# Altium schematic sheet Э3-2.SchDoc
size 840 x 594 mm; Address1: Address1; Address2: Address2; Address3: Address3; Address4: Address4; DocumentNumber: АБВГ.123456.001 Э3; SheetNumber: 2; SheetTotal: 2; Scale: 1:1; DocumentType: Схема электрическая принципиальная; FirstReferrence: АБВГ.123456.001
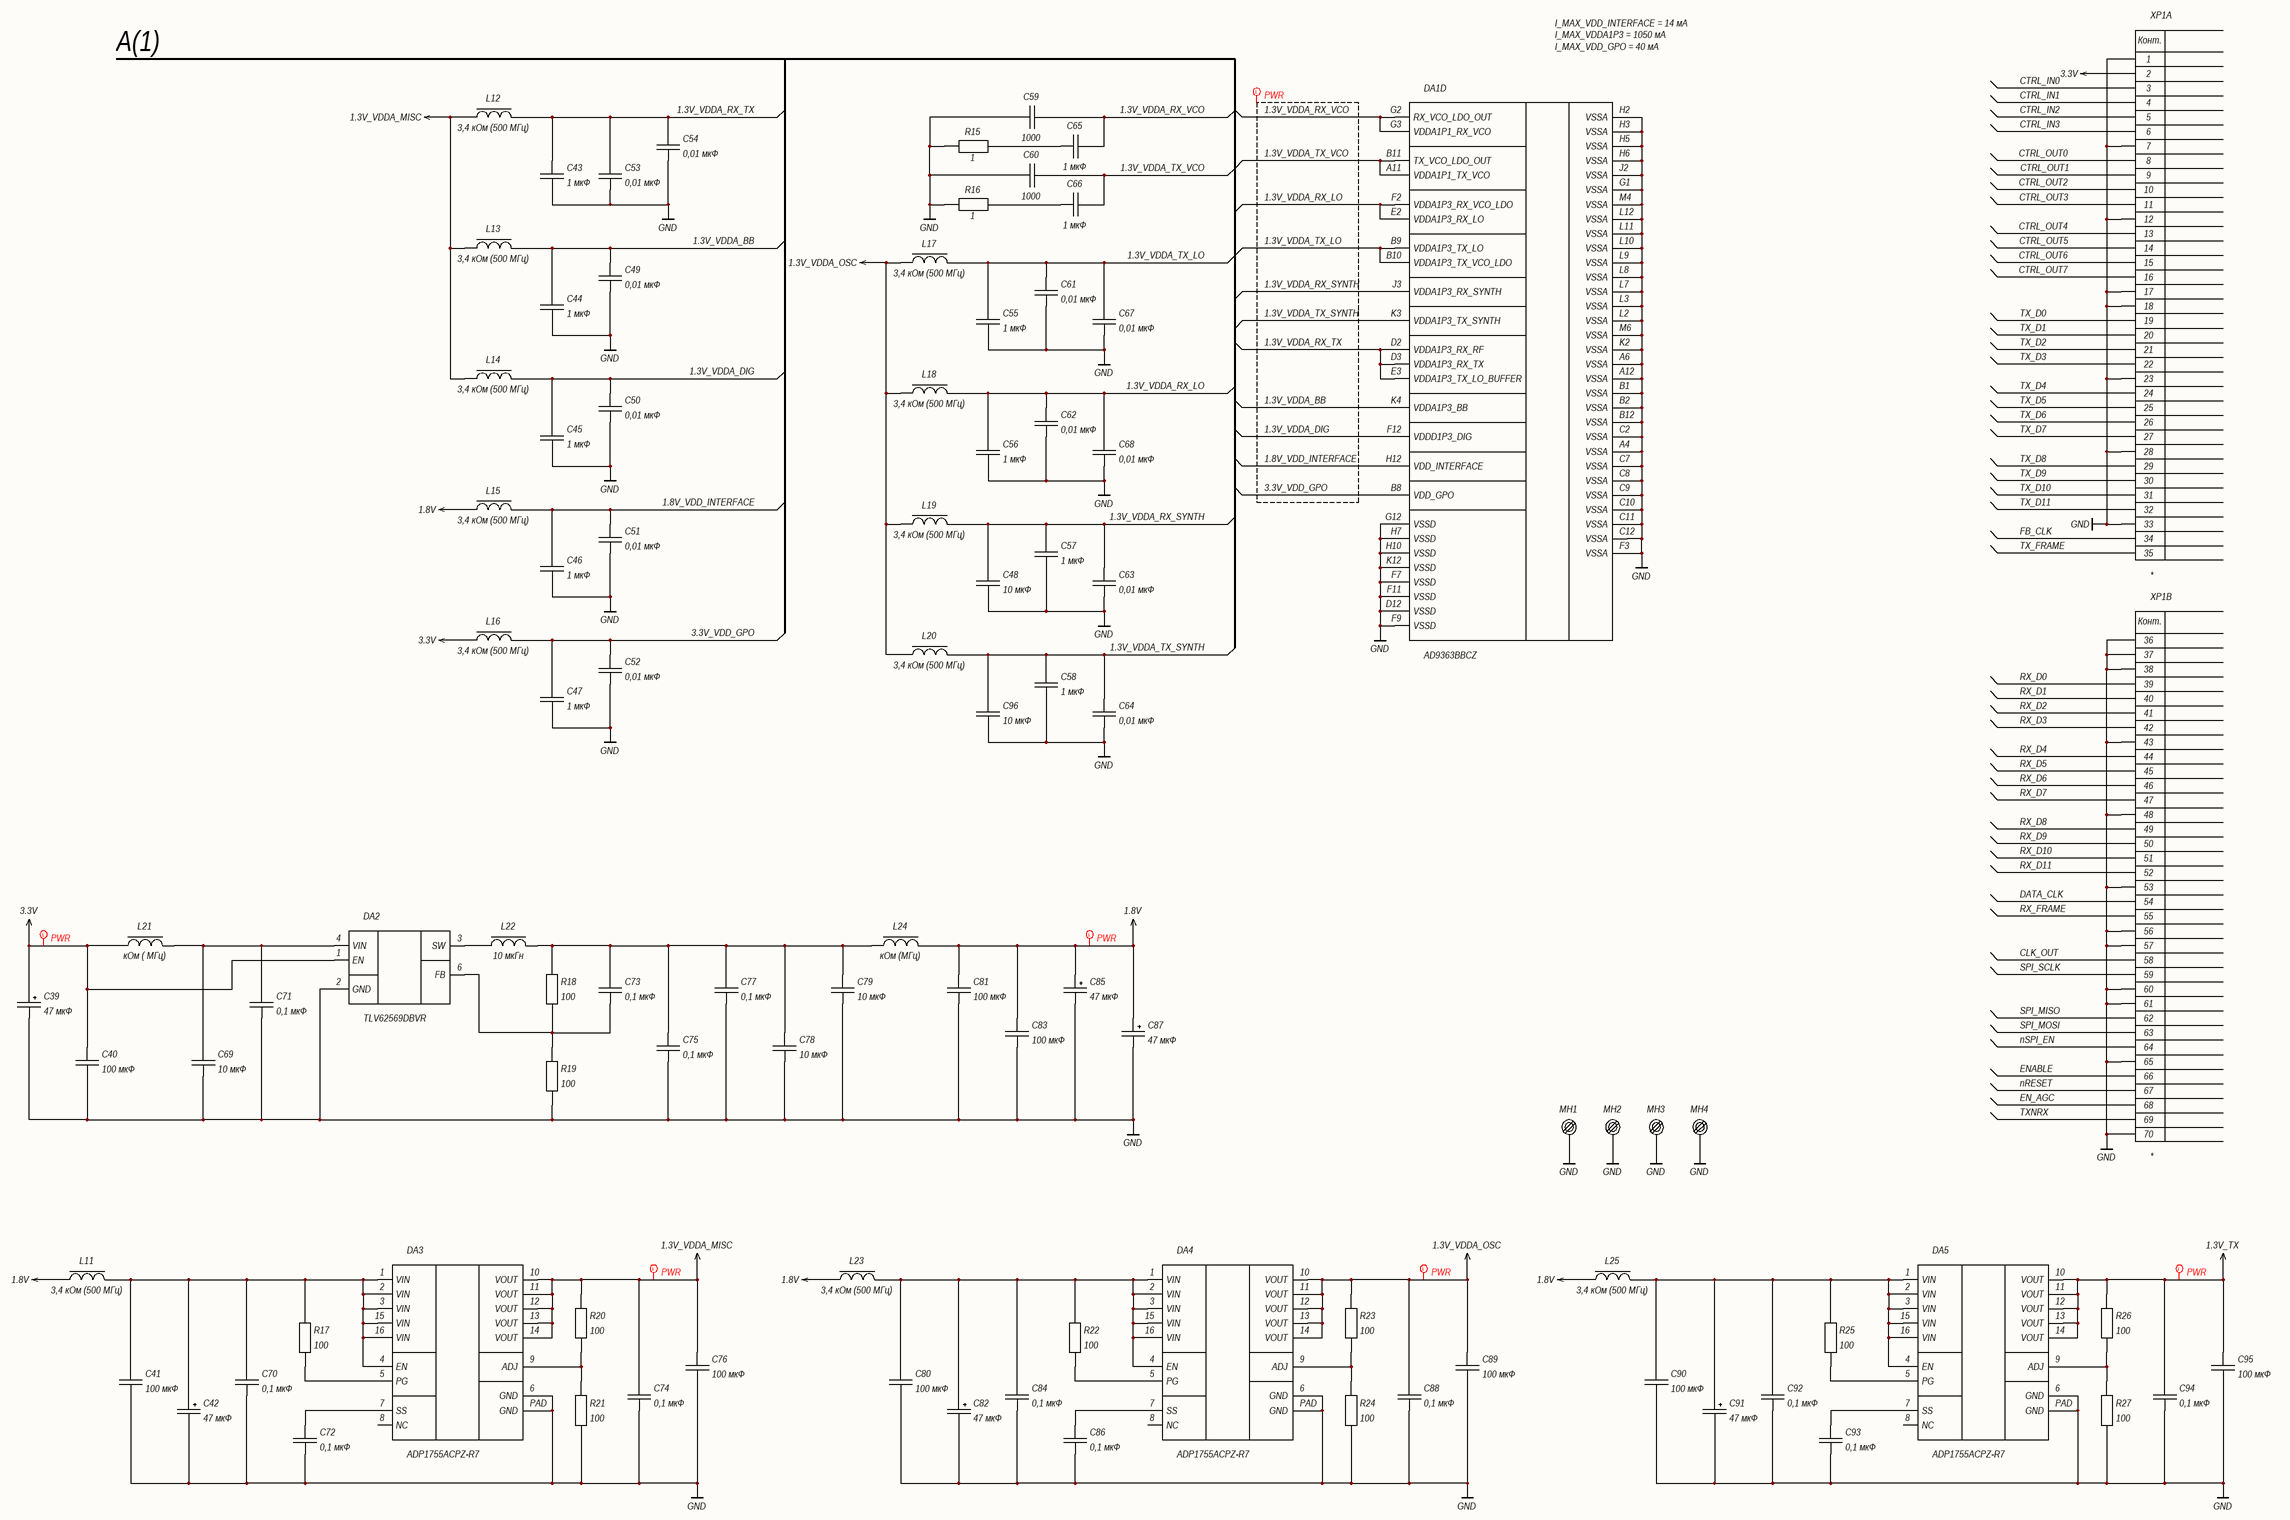
[diagram p0: Э3-2.SchDoc]

## Parts
C39  value 47 мкФ  [TL-A-B-1.8MM]
C40  value 100 мкФ  [C1206-B-1.6mm-NO]
C41  value 100 мкФ  [C1206-B-1.6mm]
C42  value 47 мкФ  [TL-A-B-1.8MM]
C43  value 1 мкФ  [C0402-B-0.5mm-NO]
C44  value 1 мкФ  [C0402-B-0.5mm-NO]
C45  value 1 мкФ  [C0402-B-0.5mm-NO]
C46  value 1 мкФ  [C0402-B-0.5mm-NO]
C47  value 1 мкФ  [C0402-B-0.5mm-NO]
C48  value 10 мкФ  [C0603-B-0.8mm-NO]
C49  value 0,01 мкФ  [C0201-B-0.3mm-NO]
C50  value 0,01 мкФ  [C0201-B-0.3mm-NO]
C51  value 0,01 мкФ  [C0201-B-0.3mm-NO]
C52  value 0,01 мкФ  [C0201-B-0.3mm-NO]
C53  value 0,01 мкФ  [C0201-B-0.3mm-NO]
C54  value 0,01 мкФ  [C0201-B-0.3mm-NO]
C55  value 1 мкФ  [C0402-B-0.5mm-NO]
C56  value 1 мкФ  [C0402-B-0.5mm-NO]
C57  value 1 мкФ  [C0402-B-0.5mm-NO]
C58  value 1 мкФ  [C0402-B-0.5mm-NO]
C59  value 1000  [C0201-B-0.3mm-NO]
C60  value 1000  [C0201-B-0.3mm-NO]
C61  value 0,01 мкФ  [C0201-B-0.3mm-NO]
C62  value 0,01 мкФ  [C0201-B-0.3mm-NO]
C63  value 0,01 мкФ  [C0201-B-0.3mm-NO]
C64  value 0,01 мкФ  [C0201-B-0.3mm-NO]
C65  value 1 мкФ  [C0402-B-0.5mm-NO]
C66  value 1 мкФ  [C0402-B-0.5mm-NO]
C67  value 0,01 мкФ  [C0201-B-0.3mm-NO]
C68  value 0,01 мкФ  [C0201-B-0.3mm-NO]
C69  value 10 мкФ  [C0603-B-0.8mm-NO]
C70  value 0,1 мкФ  [C0402-B-0.5mm-NO]
C71  value 0,1 мкФ  [C0402-B-0.5mm-NO]
C72  value 0,1 мкФ  [C0402-B-0.5mm-NO]
C73  value 0,1 мкФ  [C0402-B-0.5mm-NO]
C74  value 0,1 мкФ  [C0402-B-0.5mm-NO]
C75  value 0,1 мкФ  [C0402-B-0.5mm-NO]
C76  value 100 мкФ  [C1206-B-1.6mm]
C77  value 0,1 мкФ  [C0402-B-0.5mm-NO]
C78  value 10 мкФ  [C0603-B-0.8mm-NO]
C79  value 10 мкФ  [C0603-B-0.8mm-NO]
C80  value 100 мкФ  [C1206-B-1.6mm]
C81  value 100 мкФ  [C1206-B-1.6mm-NO]
C82  value 47 мкФ  [TL-A-B-1.8MM]
C83  value 100 мкФ  [C1206-B-1.6mm-NO]
C84  value 0,1 мкФ  [C0402-B-0.5mm-NO]
C85  value 47 мкФ  [TL-A-B-1.8MM]
C86  value 0,1 мкФ  [C0402-B-0.5mm-NO]
C87  value 47 мкФ  [TL-A-B-1.8MM]
C88  value 0,1 мкФ  [C0402-B-0.5mm-NO]
C89  value 100 мкФ  [C1206-B-1.6mm]
C90  value 100 мкФ  [C1206-B-1.6mm]
C91  value 47 мкФ  [TL-A-B-1.8MM]
C92  value 0,1 мкФ  [C0402-B-0.5mm-NO]
C93  value 0,1 мкФ  [C0402-B-0.5mm-NO]
C94  value 0,1 мкФ  [C0402-B-0.5mm-NO]
C95  value 100 мкФ  [C1206-B-1.6mm]
C96  value 10 мкФ  [C0603-B-0.8mm-NO]
DA1  AD9363BBCZ  [144-BGA]  (value not drawn)  (part D of 4)
DA2  TLV62569DBVR  [SOT-23-5]
DA3  ADP1755ACPZ-R7  [16-LFCSP-4-H0.75]
DA4  ADP1755ACPZ-R7  [16-LFCSP-4-H0.75]
DA5  ADP1755ACPZ-R7  [16-LFCSP-4-H0.75]
L11  value 3,4 кОм (500 МГц)  [L0402-B-0.5mm]
L12  value 3,4 кОм (500 МГц)  [L0402-B-0.5mm-NO]
L13  value 3,4 кОм (500 МГц)  [L0402-B-0.5mm-NO]
L14  value 3,4 кОм (500 МГц)  [L0402-B-0.5mm-NO]
L15  value 3,4 кОм (500 МГц)  [L0402-B-0.5mm-NO]
L16  value 3,4 кОм (500 МГц)  [L0402-B-0.5mm-NO]
L17  value 3,4 кОм (500 МГц)  [L0402-B-0.5mm-NO]
L18  value 3,4 кОм (500 МГц)  [L0402-B-0.5mm-NO]
L19  value 3,4 кОм (500 МГц)  [L0402-B-0.5mm-NO]
L20  value 3,4 кОм (500 МГц)  [L0402-B-0.5mm-NO]
L21  value кОм ( МГц)  [L0805-B-0.9mm]
L22  value 10 мкГн  [IHLP-2525CZ-01]
L23  value 3,4 кОм (500 МГц)  [L0402-B-0.5mm]
L24  value кОм (МГц)  [L0805-B-0.9mm]
L25  value 3,4 кОм (500 МГц)  [L0402-B-0.5mm]
MH1  Mechanical Connection  [Отверстие 3,2х7]  (value not drawn)
MH2  Mechanical Connection  [Отверстие 3,2х7]  (value not drawn)
MH3  Mechanical Connection  [Отверстие 3,2х7]  (value not drawn)
MH4  Mechanical Connection  [Отверстие 3,2х7]  (value not drawn)
R15  value 1  [CR0402-B-0.35mm-NO]
R16  value 1  [CR0402-B-0.35mm-NO]
R17  value 100  [CR0402-B-0.35mm-NO]
R18  value 100  [CR0402-B-0.35mm-NO]
R19  value 100  [CR0402-B-0.35mm-NO]
R20  value 100  [CR0402-B-0.35mm]
R21  value 100  [CR0402-B-0.35mm]
R22  value 100  [CR0402-B-0.35mm-NO]
R23  value 100  [CR0402-B-0.35mm]
R24  value 100  [CR0402-B-0.35mm]
R25  value 100  [CR0402-B-0.35mm-NO]
R26  value 100  [CR0402-B-0.35mm]
R27  value 100  [CR0402-B-0.35mm]
XP1  *  [PLD1.27-70-NO]  (parts A,B of 2)

## Nets
1.3V_TX: C94.1 C95.1 DA5.10(VOUT) DA5.11(VOUT) DA5.12(VOUT) DA5.13(VOUT) DA5.14(VOUT) R26.1
1.3V_VDDA_MISC: C74.1 C76.1 DA3.10(VOUT) DA3.11(VOUT) DA3.12(VOUT) DA3.13(VOUT) DA3.14(VOUT) L12.1 L13.1 L14.1 R20.1
1.3V_VDDA_OSC: C88.1 C89.1 DA4.10(VOUT) DA4.11(VOUT) DA4.12(VOUT) DA4.13(VOUT) DA4.14(VOUT) L17.1 L18.1 L19.1 L20.1 R23.1
1.8V: C81.1 C83.1 C85.1 C87.1 L11.1 L15.1 L23.1 L24.2 L25.1
3.3V: C39.1 C40.1 DA2.1(EN) L16.1 L21.1 XP1.2
GND: C39.2 C40.2 C41.2 C42.2 C43.2 C44.2 C45.2 C46.2 C47.2 C48.2 C49.2 C50.2 C51.2 C52.2 C53.2 C54.2 C55.2 C56.2 C57.2 C58.2 C59.1 C60.1 C61.2 C62.2 C63.2 C64.2 C67.2 C68.2 C69.2 C70.2 C71.2 C72.2 C74.2 C75.2 C76.2 C77.2 C78.2 C79.2 C80.2 C81.2 C82.2 C83.2 C84.2 C85.2 C86.2 C87.2 C88.2 C89.2 C90.2 C91.2 C92.2 C93.2 C94.2 C95.2 C96.2 DA1.A4(VSSA) DA1.A6(VSSA) DA1.A12(VSSA) DA1.B1(VSSA) DA1.B2(VSSA) DA1.B12(VSSA) DA1.C2(VSSA) DA1.C7(VSSA) DA1.C8(VSSA) DA1.C9(VSSA) DA1.C10(VSSA) DA1.C11(VSSA) DA1.C12(VSSA) DA1.D12(VSSD) DA1.F3(VSSA) DA1.F7(VSSD) DA1.F9(VSSD) DA1.F11(VSSD) DA1.G1(VSSA) DA1.G12(VSSD) DA1.H2(VSSA) DA1.H3(VSSA) DA1.H5(VSSA) DA1.H6(VSSA) DA1.H7(VSSD) DA1.H10(VSSD) DA1.J2(VSSA) DA1.K2(VSSA) DA1.K12(VSSD) DA1.L2(VSSA) DA1.L3(VSSA) DA1.L7(VSSA) DA1.L8(VSSA) DA1.L9(VSSA) DA1.L10(VSSA) DA1.L11(VSSA) DA1.L12(VSSA) DA1.M4(VSSA) DA1.M6(VSSA) DA2.2(GND) DA3.6(GND) DA3.PAD(GND) DA4.6(GND) DA4.PAD(GND) DA5.6(GND) DA5.PAD(GND) MH1.0 MH2.0 MH3.0 MH4.0 R15.1 R16.1 R19.2 R21.2 R24.2 R27.2 XP1.1 XP1.7 XP1.12 XP1.17 XP1.18 XP1.23 XP1.28 XP1.33 XP1.36 XP1.37 XP1.38 XP1.43 XP1.48 XP1.53 XP1.56 XP1.57 XP1.60 XP1.61 XP1.65 XP1.70
1.3V_VDDA_BB: C44.1 C49.1 DA1.K4(VDDA1P3_BB) L13.2
1.3V_VDDA_DIG: C45.1 C50.1 DA1.F12(VDDD1P3_DIG) L14.2
1.3V_VDDA_RX_LO: C56.1 C62.1 C68.1 DA1.E2(VDDA1P3_RX_LO) DA1.F2(VDDA1P3_RX_VCO_LDO) L18.2
1.3V_VDDA_RX_SYNTH: C48.1 C57.1 C63.1 DA1.J3(VDDA1P3_RX_SYNTH) L19.2
1.3V_VDDA_RX_TX: C43.1 C53.1 C54.1 DA1.D2(VDDA1P3_RX_RF) DA1.D3(VDDA1P3_RX_TX) DA1.E3(VDDA1P3_TX_LO_BUFFER) L12.2
1.3V_VDDA_RX_VCO: C59.2 C65.2 DA1.G2(RX_VCO_LDO_OUT) DA1.G3(VDDA1P1_RX_VCO)
1.3V_VDDA_TX_LO: C55.1 C61.1 C67.1 DA1.B9(VDDA1P3_TX_LO) DA1.B10(VDDA1P3_TX_VCO_LDO) L17.2
1.3V_VDDA_TX_SYNTH: C58.1 C64.1 C96.1 DA1.K3(VDDA1P3_TX_SYNTH) L20.2
1.3V_VDDA_TX_VCO: C60.2 C66.2 DA1.A11(VDDA1P1_TX_VCO) DA1.B11(TX_VCO_LDO_OUT)
1.8V_VDD_INTERFACE: C46.1 C51.1 DA1.H12(VDD_INTERFACE) L15.2
3.3V_VDD_GPO: C47.1 C52.1 DA1.B8(VDD_GPO) L16.2
CLK_OUT: XP1.58
CTRL_IN0: XP1.3
CTRL_IN1: XP1.4
CTRL_IN2: XP1.5
CTRL_IN3: XP1.6
CTRL_OUT0: XP1.8
CTRL_OUT1: XP1.9
CTRL_OUT2: XP1.10
CTRL_OUT3: XP1.11
CTRL_OUT4: XP1.13
CTRL_OUT5: XP1.14
CTRL_OUT6: XP1.15
CTRL_OUT7: XP1.16
DATA_CLK: XP1.54
EN_AGC: XP1.68
ENABLE: XP1.66
FB_CLK: XP1.34
nRESET: XP1.67
nSPI_EN: XP1.64
RX_D0: XP1.39
RX_D1: XP1.40
RX_D2: XP1.41
RX_D3: XP1.42
RX_D4: XP1.44
RX_D5: XP1.45
RX_D6: XP1.46
RX_D7: XP1.47
RX_D8: XP1.49
RX_D9: XP1.50
RX_D10: XP1.51
RX_D11: XP1.52
RX_FRAME: XP1.55
SPI_MISO: XP1.62
SPI_MOSI: XP1.63
SPI_SCLK: XP1.59
TX_D0: XP1.19
TX_D1: XP1.20
TX_D2: XP1.21
TX_D3: XP1.22
TX_D4: XP1.24
TX_D5: XP1.25
TX_D6: XP1.26
TX_D7: XP1.27
TX_D8: XP1.29
TX_D9: XP1.30
TX_D10: XP1.31
TX_D11: XP1.32
TX_FRAME: XP1.35
TXNRX: XP1.69
NetC41_1: C41.1 C42.1 C70.1 DA3.1(VIN) DA3.2(VIN) DA3.3(VIN) DA3.4(EN) DA3.15(VIN) DA3.16(VIN) L11.2 R17.1
NetC65_1: C65.1 R15.2
NetC66_1: C66.1 R16.2
NetC69_1: C69.1 C71.1 DA2.4(VIN) L21.2
NetC72_1: C72.1 DA3.7(SS)
NetC73_1: C73.1 C75.1 C77.1 C78.1 C79.1 L22.2 L24.1 R18.1
NetC73_2: C73.2 DA2.6(FB) R18.2 R19.1
NetC80_1: C80.1 C82.1 C84.1 DA4.1(VIN) DA4.2(VIN) DA4.3(VIN) DA4.4(EN) DA4.15(VIN) DA4.16(VIN) L23.2 R22.1
NetC86_1: C86.1 DA4.7(SS)
NetC90_1: C90.1 C91.1 C92.1 DA5.1(VIN) DA5.2(VIN) DA5.3(VIN) DA5.4(EN) DA5.15(VIN) DA5.16(VIN) L25.2 R25.1
NetC93_1: C93.1 DA5.7(SS)
NetDA2_3: DA2.3(SW) L22.1
NetDA3_5: DA3.5(PG) R17.2
NetDA3_9: DA3.9(ADJ) R20.2 R21.1
NetDA4_5: DA4.5(PG) R22.2
NetDA4_9: DA4.9(ADJ) R23.2 R24.1
NetDA5_5: DA5.5(PG) R25.2
NetDA5_9: DA5.9(ADJ) R26.2 R27.1

Not connected (* = marked no-connect by the designer): DA3 8(NC); DA4 8(NC); DA5 8(NC)

## Layout directives
net class PWR: 1.3V_TX, 1.3V_VDDA_BB, 1.3V_VDDA_DIG, 1.3V_VDDA_MISC, 1.3V_VDDA_OSC, 1.3V_VDDA_RX_LO, 1.3V_VDDA_RX_SYNTH, 1.3V_VDDA_RX_TX, 1.3V_VDDA_RX_VCO, 1.3V_VDDA_TX_LO, 1.3V_VDDA_TX_SYNTH, 1.3V_VDDA_TX_VCO, 1.8V, 1.8V_VDD_INTERFACE, 3.3V, 3.3V_VDD_GPO

## Notes on the sheet
- A(1)
- (near DA1) I_MAX_VDD_INTERFACE = 14 мА
  I_MAX_VDDA1P3 = 1050 мА
  I_MAX_VDD_GPO = 40 мА
- Перв. примен.
- Справ. №
- Подп. и дата
- Инв. № дубл.
- Взам. инв. №
- Инв. № подл.
- Изм.
- Лист
- № докум.
- Подп.
- Дата
- 2.106-A2
- Копировал
- Формат А1
- (in symbol XP_70_Pin_Open, part A) Конт.
- (in symbol XP_70_Pin_Open, part B) Конт.

## Library data of the parts
C39 C42 C82 C85 C87 C91 = Polar Ver.: TemperatureRange: -XX...+XX°C; Manufacturer: *; PartNumber: *; Package: *; HelpURL: *; Tolerance: *; Impedance: *; ESR: *; ComponentType: CAP
C40 C41 C76 C80 C81 C83 C89 C90 C95 = Non Polar Ver.: 1206 100 мкФ ±20% 6,3 В X5R; TemperatureRange: -XX...+XX°C; Manufacturer: *; PartNumber: *; Package: *; HelpURL: *; Tolerance: *; TypeDielectric: *; ESR: *; ComponentType: CAP; VoltageRating: *
C43-C47 C55-C58 = Non Polar Ver.: 0402 1 мкФ ±10% 16 В X7R; TemperatureRange: -XX...+XX°C; Manufacturer: *; PartNumber: *; Package: *; HelpURL: *; Tolerance: *; TypeDielectric: *; ESR: *; ComponentType: CAP; VoltageRating: *
C48 C69 C78 C79 C96 = Non Polar Ver.: 0603 10 мкФ ±10% 16 В X7R; TemperatureRange: -XX...+XX°C; Manufacturer: *; PartNumber: *; Package: *; HelpURL: *; Tolerance: *; TypeDielectric: *; ESR: *; ComponentType: CAP; VoltageRating: *
C49-C54 C61-C64 C67 C68 = Non Polar Ver.: 0201 0,01 мкФ ±10% 16 В X7R; TemperatureRange: -XX...+XX°C; Manufacturer: *; PartNumber: *; Package: *; HelpURL: *; Tolerance: *; TypeDielectric: *; ESR: *; ComponentType: CAP; VoltageRating: *
C59 C60 = Non Polar Hor.: 0201 1000 пФ ±10% 16 В X7R; TemperatureRange: -XX...+XX°C; Manufacturer: *; PartNumber: *; Package: *; HelpURL: *; Tolerance: *; TypeDielectric: *; ESR: *; ComponentType: CAP; VoltageRating: *
C65 C66 = Non Polar Hor.: 0402 1 мкФ ±10% 16 В X7R; TemperatureRange: -XX...+XX°C; Manufacturer: *; PartNumber: *; Package: *; HelpURL: *; Tolerance: *; TypeDielectric: *; ESR: *; ComponentType: CAP; VoltageRating: *
C70-C75 C77 C84 C86 C88 C92-C94 = Non Polar Ver.: 0402 0,1 мкФ ±10% 16 В X7R; TemperatureRange: -XX...+XX°C; Manufacturer: *; PartNumber: *; Package: *; HelpURL: *; Tolerance: *; TypeDielectric: *; ESR: *; ComponentType: CAP; VoltageRating: *
DA1 = AD9363: RF Agile Transceiver; Manufacturer: AnalogDevices; TemperatureRange: -40...+85°C; Package: *; PartNumber: AD9363BBCZ; ComponentType: RF; DatasheetURL: *; HelpURL: *; PinCount: 144
DA2 = TLV62569DBV: 2-A High Efficiency Synchronous Buck Converter in SOT Package; Manufacturer: Texas Instruments, Inc.; TemperatureRange: -40...+85°C; Package: SOT-23; PartNumber: TLV62569DBVR; ComponentType: IC; DatasheetURL: *; HelpURL: *; PinCount: 6
DA3-DA5 = ADP1755ACPZ-R7: 1.2 A, Ultralow Noise, / High PSRR, RF Linear Regulator; Manufacturer: Analog Devices, Inc.; TemperatureRange: -40...+125°C; Package: 16-LFCSP_WQ; PartNumber: ADP1755ACPZ-R7; ComponentType: IC; DatasheetURL: *; HelpURL: *; PinCount: 16
L11-L20 L23-L25 = Inductor MC Hor.: PartNumber: BLM15HD182BH1; TemperatureRange: -XX...+XX°C; Manufacturer: *; Package: *; HelpURL: *; MaxCurrent: *; ComponentType: IND; DatasheetURL: *; PinCount: 2
L21 = Inductor MC Hor.: TemperatureRange: -XX...+XX°C; Manufacturer: *; Package: *; HelpURL: *; MaxCurrent: *; ComponentType: IND; DatasheetURL: *; PinCount: 2
L22 = Inductor MC Hor.: PartNumber: IHLP2525CZER100M01; TemperatureRange: -XX...+XX°C; Manufacturer: *; Package: *; HelpURL: *; MaxCurrent: *; ComponentType: IND; DatasheetURL: *; PinCount: 2
R15 R16 = Resistor Hor.: 0402 1 Ом ±1%; TemperatureRange: -XX...+XX°C; Manufacturer: *; PartNumber: *; Package: *; HelpURL: *; PowerRating: *; Tolerance: *; DatasheetURL: *; ComponentType: RES
R17-R27 = Resistor Ver.: 0402 100 Ом ±1%; TemperatureRange: -XX...+XX°C; Manufacturer: *; PartNumber: *; Package: *; HelpURL: *; PowerRating: *; DatasheetURL: *; Tolerance: *; ComponentType: RES
XP1 = XP_70_Pin_Open: TemperatureRange: -XX...+XX°C; Manufacturer: *; Package: *; HelpURL: *; DatasheetURL: *; PartNumber: *; PinCount: 70; ComponentType: Connector
MH1-MH4 = Mechanical Connection: ClassName: DC